# Altium schematic sheet main.SchDoc
size A
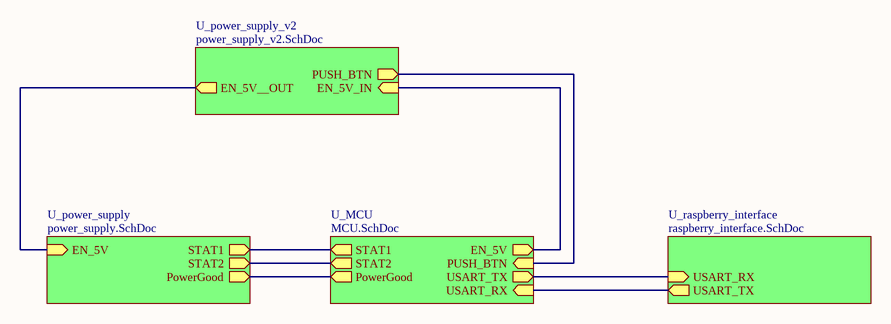
[diagram p0: main.SchDoc]

## Sub-sheets
U_MCU = MCU.SchDoc: STAT2 (out), STAT1 (out), PowerGood (out), EN_5V (out), USART_TX (out), USART_RX (in), PUSH_BTN (in)
U_power_supply = power_supply.SchDoc: STAT1 (out), STAT2 (out), PowerGood (out), EN_5V (in)
U_power_supply_v2 = power_supply_v2.SchDoc: EN_5V_IN (in), EN_5V__OUT (out), PUSH_BTN (out)
U_raspberry_interface = raspberry_interface.SchDoc: USART_TX (out), USART_RX (in)

## Nets
(unnamed): sheet U_MCU/STAT2, sheet U_power_supply/STAT2
(unnamed): sheet U_MCU/STAT1, sheet U_power_supply/STAT1
(unnamed): sheet U_MCU/PowerGood, sheet U_power_supply/PowerGood
(unnamed): sheet U_MCU/EN_5V, sheet U_power_supply_v2/EN_5V_IN
(unnamed): sheet U_MCU/USART_TX, sheet U_raspberry_interface/USART_RX
(unnamed): sheet U_MCU/USART_RX, sheet U_raspberry_interface/USART_TX
(unnamed): sheet U_MCU/PUSH_BTN, sheet U_power_supply_v2/PUSH_BTN
(unnamed): sheet U_power_supply/EN_5V, sheet U_power_supply_v2/EN_5V__OUT